# EAGLE schematic Child_Board_Motor (EAGLE 9.6.1)
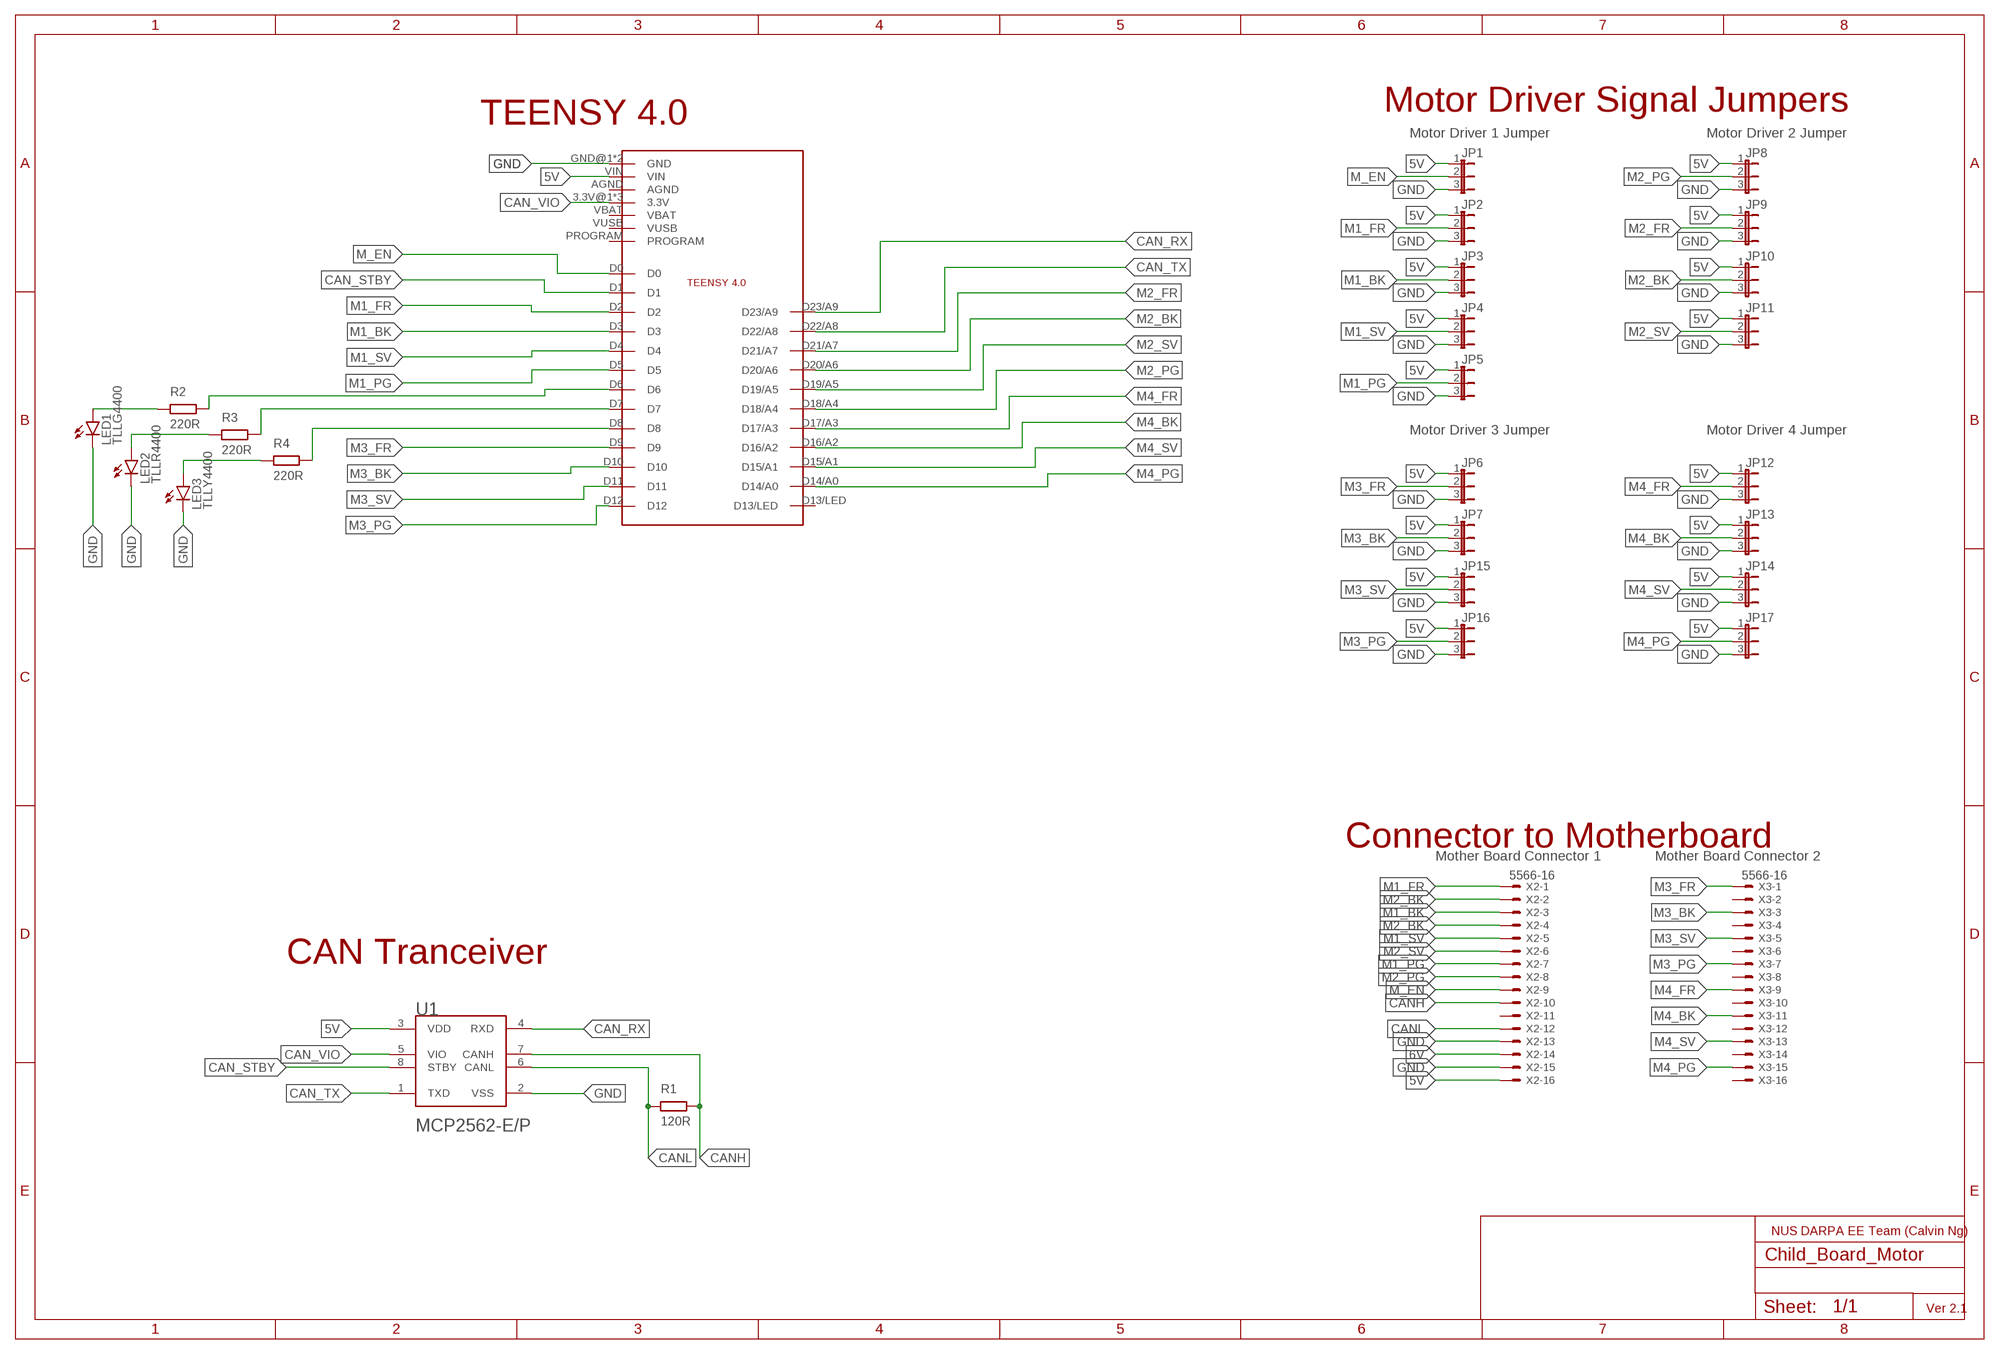
[diagram p0: schematic, sheet 1]

## Parts
JP1  JP2E  [JP2]
JP2  JP2E  [JP2]
JP3  JP2E  [JP2]
JP4  JP2E  [JP2]
JP5  JP2E  [JP2]
JP6  JP2E  [JP2]
JP7  JP2E  [JP2]
JP8  JP2E  [JP2]
JP9  JP2E  [JP2]
JP10  JP2E  [JP2]
JP11  JP2E  [JP2]
JP12  JP2E  [JP2]
JP13  JP2E  [JP2]
JP14  JP2E  [JP2]
JP15  JP2E  [JP2]
JP16  JP2E  [JP2]
JP17  JP2E  [JP2]
LED1  TLLG4400  [LED3MM]
LED2  TLLR4400  [LED3MM]
LED3  TLLY4400  [LED3MM]
R1  120R  R  (no package)
R2  220R  R  (no package)
R3  220R  R  (no package)
R4  220R  R  (no package)
U1  MICROCHIP_MCP2562-E-PMICROCHIP_MCP2562-E-P_0_0  [MICROCHIP_MCP2562-E-P_0]
U$1  TEENSY4.0  [TEENSY4.0]
X2  5566-16  [5566-16]
X3  5566-16  [5566-16]

## Nets
5V: JP1.1 JP2.1 JP3.1 JP4.1 JP5.1 JP6.1 JP7.1 JP8.1 JP9.1 JP10.1 JP11.1 JP12.1 JP13.1 JP14.1 JP15.1 JP16.1 JP17.1 U1.3(VDD) U$1.VIN X2.16
6V: X2.14
CAN_RX: U1.4(RXD) U$1.D23/A9
CAN_STBY: U1.8(STBY) U$1.D1
CAN_TX: U1.1(TXD) U$1.D22/A8
CAN_VIO: U1.5(VIO) U$1.3.3V@1(3.3V) U$1.3.3V@2(3.3V) U$1.ON/OFF(3.3V)
CANH: R1.2 U1.7(CANH) X2.10
CANL: R1.1 U1.6(CANL) X2.12
GND: JP1.3 JP2.3 JP3.3 JP4.3 JP5.3 JP6.3 JP7.3 JP8.3 JP9.3 JP10.3 JP11.3 JP12.3 JP13.3 JP14.3 JP15.3 JP16.3 JP17.3 LED1.K(C) LED2.K(C) LED3.K(C) U1.2(VSS) U$1.GND@1(GND) U$1.GND@2(GND) X2.13 X2.15
M1_BK: JP3.2 U$1.D3 X2.3
M1_FR: JP2.2 U$1.D2 X2.1
M1_PG: JP5.2 U$1.D5 X2.7
M1_SV: JP4.2 U$1.D4 X2.5
M2_BK: JP10.2 U$1.D20/A6 X2.2 X2.4
M2_FR: JP9.2 U$1.D21/A7
M2_PG: JP8.2 U$1.D18/A4 X2.8
M2_SV: JP11.2 U$1.D19/A5 X2.6
M3_BK: JP7.2 U$1.D10 X3.3
M3_FR: JP6.2 U$1.D9 X3.1
M3_PG: JP16.2 U$1.D12 X3.7
M3_SV: JP15.2 U$1.D11 X3.5
M4_BK: JP13.2 U$1.D16/A2 X3.11
M4_FR: JP12.2 U$1.D17/A3 X3.9
M4_PG: JP17.2 U$1.D14/A0 X3.15
M4_SV: JP14.2 U$1.D15/A1 X3.13
M_EN: JP1.2 U$1.D0 X2.9
N$1: R2.2 U$1.D6
N$2: R3.2 U$1.D7
N$3: R4.2 U$1.D8
N$4: LED1.A R2.1
N$9: LED2.A R3.1
N$10: LED3.A R4.1
Unconnected: U$1.AGND U$1.D13/LED U$1.PROGRAM U$1.VBAT U$1.VUSB X2.11 X3.2 X3.4 X3.6 X3.8 X3.10 X3.12 X3.14 X3.16

## Notes on the sheet
- Motor Driver Signal Jumpers
- TEENSY 4.0
- Motor Driver 1 Jumper | Motor Driver 2 Jumper
- Motor Driver 3 Jumper | Motor Driver 4 Jumper
- Connector to Motherboard
- Mother Board Connector 1 | Mother Board Connector 2
- CAN Tranceiver
- NUS DARPA EE Team (Calvin Ng)
- Ver 2.1

## Library data of the parts
JP1-JP17 = jumper:JP2E: JUMPER
LED1 = led:TLLG4400: Low Current (2mA) LED 3 mm Tinted Diffused Package color GREEN Source: Data sheet <http://www.farnell.com/datasheets/391098.pdf>; MF: VISHAY SEMICONDUCTOR; OC_FARNELL: 1612435
LED2 = led:TLLR4400: Low Current (2mA) LED 3 mm Tinted Diffused Package color RED Source: Data sheet <http://www.farnell.com/datasheets/391100.pdf>; MF: VISHAY SEMICONDUCTOR; OC_FARNELL: 1612437
LED3 = led:TLLY4400: Low Current (2mA) LED 3 mm Tinted Diffused Package color YELLOW Source: Data sheet <http://www.farnell.com/datasheets/391098.pdf>; MF: VISHAY SEMICONDUCTOR; OC_FARNELL: 1612439
R1-R4 = ngspice-simulation:R: RESISTOR
U1 = P:MICROCHIP_MCP2562-E-P: High-Speed CAN Transceiver; CENTROID_NOT_SPECIFIED: No; DATASHEET: https://upverter.com/datasheet/b25546fff9d94e99fcb0dd0aedffb11e407de813.pdf; DIGIKEY_DESCRIPTION: IC TXRX CAN 8DIP; DIGIKEY_PART_NUMBER: MCP2562-E/P-ND; IMPORTED_FROM: octopart; IPC_LAND_PATTERN_NAME: DIP787W46P254L927H533Q8; LEAD_FREE: yes; MF: Microchip; MOUSER_PART_NUMBER: 579-MCP2562-E/P; MPN: MCP2562-E/P; NUM_PINS: 8; OCTOPART_PART_NUMBER: 926e5ad67c164da9; PACKAGE: PDIP8; PREFIX: U; ROHS: yes; TEMPERATURE_RANGE_HIGH: +125°C; TEMPERATURE_RANGE_LOW: -40°C
U$1 = Teensy4.0:TEENSY4.0
X2 X3 = con-molex:5566-16: Mini FIT connector 16 pol Source: http://www.molex.com; MF: MOLEX; OC_FARNELL: unknown; OC_NEWARK: unknown